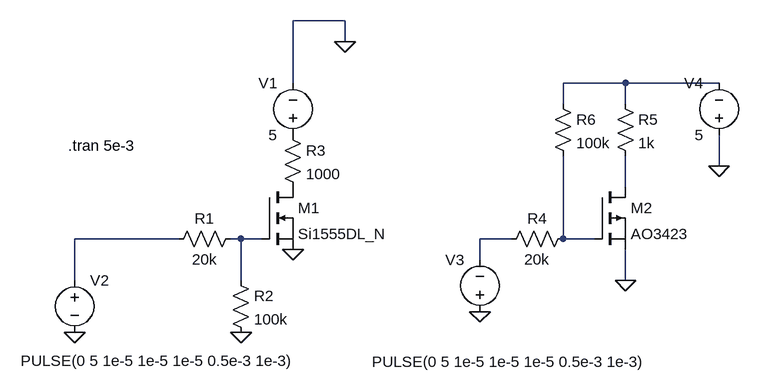
[diagram p0: schematic MOSFET switch.asc]
MOSFET switch.asc, the LTspice schematic file:
Version 4
SHEET 1 1284 680
WIRE 272 -160 192 -160
WIRE 272 -128 272 -160
WIRE 192 -64 192 -160
WIRE 704 -64 608 -64
WIRE 848 -64 704 -64
WIRE 608 -32 608 -64
WIRE 704 -32 704 -64
WIRE 848 64 848 16
WIRE 704 96 704 48
WIRE 16 176 -144 176
WIRE 112 176 96 176
WIRE 144 176 112 176
WIRE 528 176 480 176
WIRE 608 176 608 48
WIRE 656 176 608 176
WIRE 480 208 480 176
WIRE -144 240 -144 176
WIRE 112 240 112 176
WIRE 704 240 704 192
FLAG 112 320 0
FLAG 192 192 0
FLAG -144 320 0
FLAG 272 -128 0
FLAG 480 288 0
FLAG 848 64 0
FLAG 704 240 0
SYMBOL nmos 144 96 R0
SYMATTR InstName M1
SYMATTR Value Si1555DL_N
SYMBOL res 112 160 R90
WINDOW 0 0 56 VBottom 2
WINDOW 3 32 56 VTop 2
SYMATTR InstName R1
SYMATTR Value 20k
SYMBOL res 176 0 R0
SYMATTR InstName R3
SYMATTR Value 1000
SYMBOL voltage 192 32 R180
WINDOW 0 24 96 Left 2
WINDOW 3 24 16 Left 2
WINDOW 123 0 0 Left 0
WINDOW 39 0 0 Left 0
SYMATTR InstName V1
SYMATTR Value 5
SYMBOL voltage -144 224 R0
WINDOW 3 -83 140 Left 2
WINDOW 123 0 0 Left 0
WINDOW 39 0 0 Left 0
SYMATTR InstName V2
SYMATTR Value PULSE(0 5 1e-5 1e-5 1e-5 0.5e-3 1e-3)
SYMBOL res 96 224 R0
SYMATTR InstName R2
SYMATTR Value 100k
SYMBOL pmos 656 96 R0
SYMATTR InstName M2
SYMATTR Value AO3423
SYMBOL voltage 480 304 R180
WINDOW 0 24 96 Left 2
WINDOW 3 -260 -61 Left 2
WINDOW 123 0 0 Left 0
WINDOW 39 0 0 Left 0
SYMATTR InstName V3
SYMATTR Value PULSE(0 5 1e-5 1e-5 1e-5 0.5e-3 1e-3)
SYMBOL res 624 160 R90
WINDOW 0 0 56 VBottom 2
WINDOW 3 32 56 VTop 2
SYMATTR InstName R4
SYMATTR Value 20k
SYMBOL res 688 -48 R0
SYMATTR InstName R5
SYMATTR Value 1k
SYMBOL voltage 848 32 R180
WINDOW 0 24 96 Left 2
WINDOW 3 24 16 Left 2
WINDOW 123 0 0 Left 0
WINDOW 39 0 0 Left 0
SYMATTR InstName V4
SYMATTR Value 5
SYMBOL res 592 -48 R0
SYMATTR InstName R6
SYMATTR Value 100k
TEXT -154 32 Left 2 !.tran 5e-3

The netlist it stands for:
* MOSFET switch.asc
M1 P001 N004 0 0 Si1555DL_N
R1 N004 N003 20k
R3 P002 P001 1000
V1 P002 0 5
V2 N003 0 PULSE(0 5 1e-5 1e-5 1e-5 0.5e-3 1e-3)
R2 N004 0 100k
M2 N002 N006 0 0 AO3423
V3 0 N005 PULSE(0 5 1e-5 1e-5 1e-5 0.5e-3 1e-3)
R4 N006 N005 20k
R5 N001 N002 1k
V4 0 N001 5
R6 N001 N006 100k
.model NMOS NMOS
.model PMOS PMOS
.lib standard.mos
.tran 5e-3
.backanno
.end